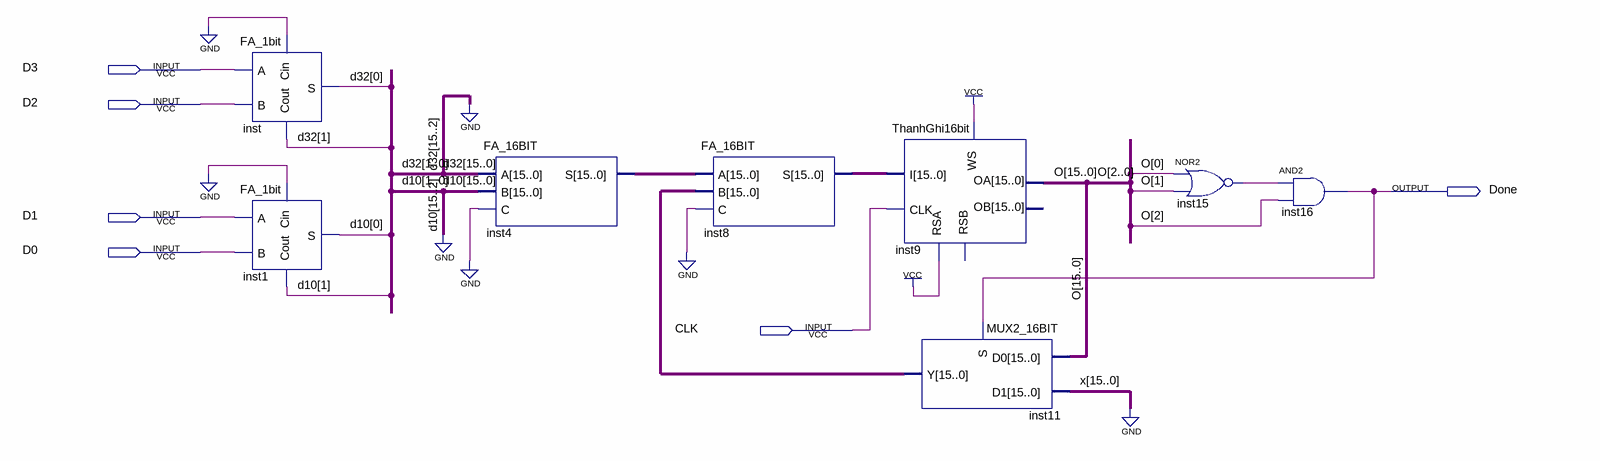
[diagram p0: schematic sheet]
// Quartus schematic SoSanh4.bdf as structural Verilog: 8 symbols, 6 pins
module SoSanh4 (
  input  D3,
  input  D2,
  input  D1,
  input  D0,
  input  CLK,
  output Done
);

  wire inst15_out;
  wire [1:0] d10, d32;
  wire [15:0] inst4_s, inst8_s, inst11_y, O;

  FA_1bit inst (.A(D3), .B(D2), .Cin(1'b0), .S(d32[0]), .Cout(d32[1]));
  FA_1bit inst1 (.A(D1), .B(D0), .Cin(1'b0), .S(d10[0]), .Cout(d10[1]));
  FA_16BIT inst4 (.A({{14{1'b0}}, d32}), .B({{14{1'b0}}, d10}), .C(1'b0), .S(inst4_s));
  FA_16BIT inst8 (.A(inst4_s), .B(inst11_y), .C(1'b0), .S(inst8_s));
  ThanhGhi16bit inst9 (.I(inst8_s), .WS(1'b1), .RSA(1'b1), .CLK(CLK), .OA(O));  // open: RSB, OB
  MUX2_16BIT inst11 (.S(Done), .D1({16{1'b0}}), .D0(O), .Y(inst11_y));
  nor inst15 (inst15_out, O[0], O[1]);
  and inst16 (Done, inst15_out, O[2]);
endmodule
